# Altium schematic sheet Microcontroller.SchDoc
size A4; SheetNumber: 6; SheetTotal: 9
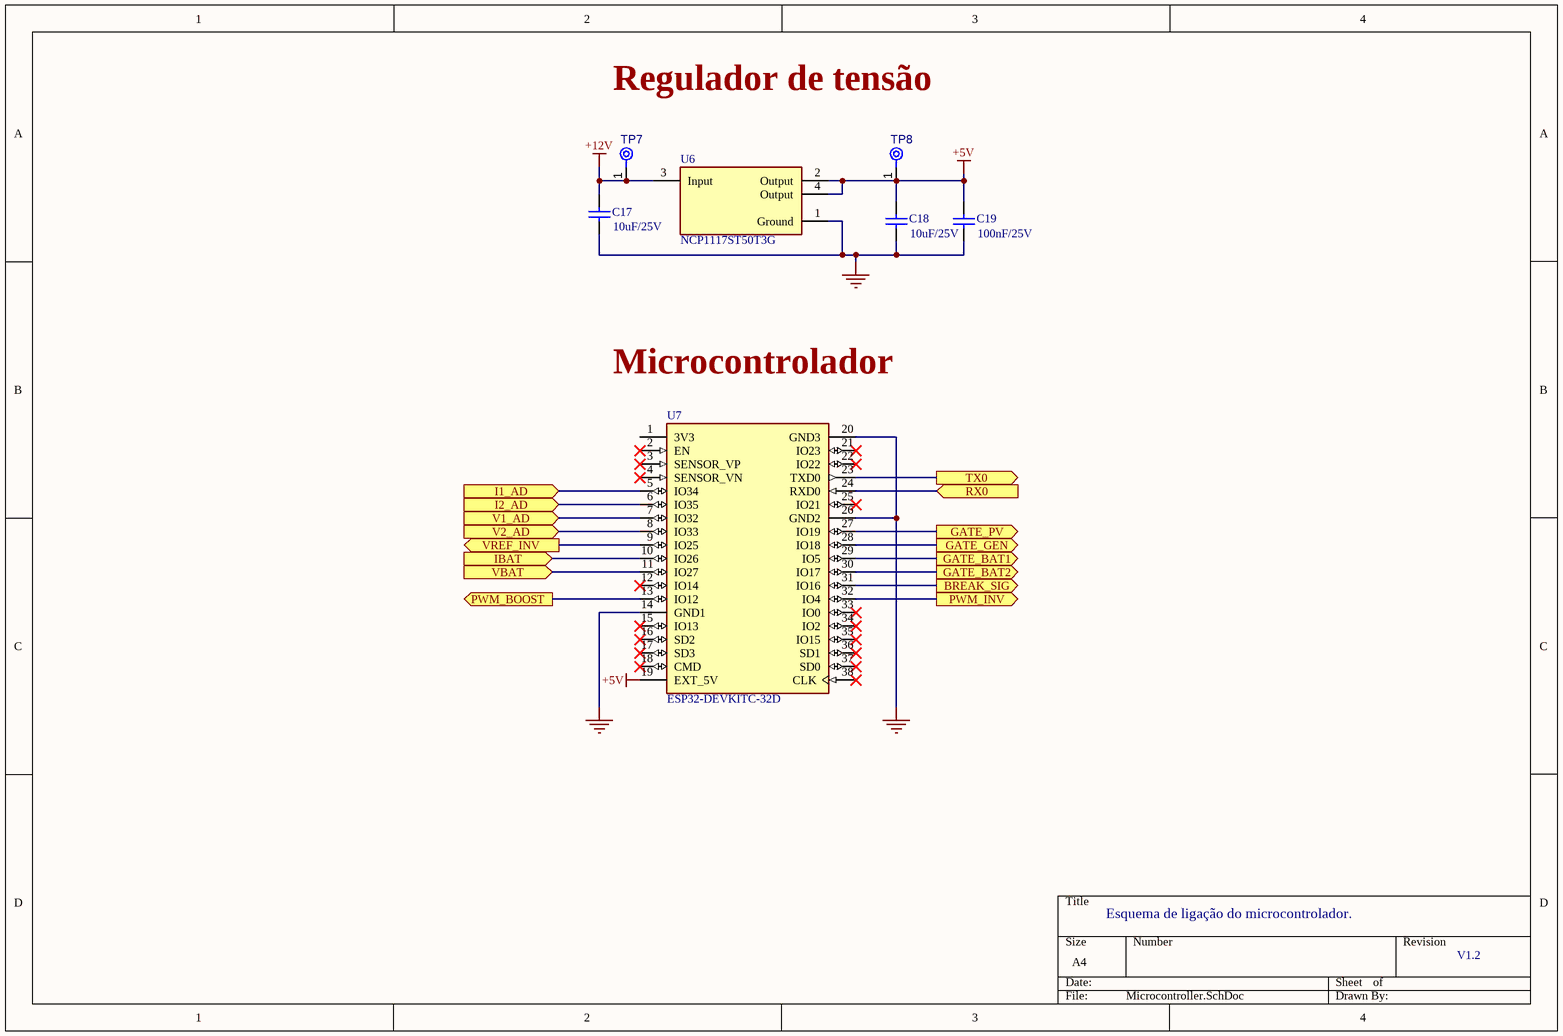
[diagram p0: Microcontroller.SchDoc]

## Parts
C17  value 10uF/25V  [C1206]  (hidden comment: Cap Semi)
C18  value 10uF/25V  [C1206]  (hidden comment: Cap Semi)
C19  value 100nF/25V  [C1206]  (hidden comment: Cap Semi)
TP7  TPAD6R  [TP06R]  (value not drawn)  (no BOM)
TP8  TPAD6R  [TP06R]  (value not drawn)  (no BOM)
U6  NCP1117ST50T3G  [FP-318H-MFG]
U7  ESP32-DEVKITC-32D  [MODULE_ESP32-DEVKITC-32D]

## Ports
BREAK_SIG (out), GATE_BAT1 (out), GATE_BAT2 (out), GATE_GEN (out), GATE_PV (out), I1_AD (in), I2_AD (in), IBAT (in), PWM_BOOST (out), PWM_INV (out), RX0 (in), TX0 (out), V1_AD (in), V2_AD (in), VBAT (in), VREF_INV (out)

## Nets
+5V: C18.2 C19.2 TP8.1(TP) U6.2(Output) U6.4(Output) U7.19(EXT_5V)
+12V: C17.2 TP7.1(TP) U6.3(Input)
GND: C17.1 C18.1 C19.1 U6.1(Ground) U7.14(GND1) U7.20(GND3) U7.26(GND2)
BREAK_SIG: U7.31(IO16) ; port BREAK_SIG
GATE_BAT1: U7.29(IO5) ; port GATE_BAT1
GATE_BAT2: U7.30(IO17) ; port GATE_BAT2
GATE_GEN: U7.28(IO18) ; port GATE_GEN
GATE_PV: U7.27(IO19) ; port GATE_PV
I1_AD: U7.5(IO34) ; port I1_AD
I2_AD: U7.6(IO35) ; port I2_AD
IBAT: U7.10(IO26) ; port IBAT
PWM_BOOST: U7.13(IO12) ; port PWM_BOOST
PWM_INV: U7.32(IO4) ; port PWM_INV
RX0: U7.24(RXD0) ; port RX0
TX0: U7.23(TXD0) ; port TX0
V1_AD: U7.7(IO32) ; port V1_AD
V2_AD: U7.8(IO33) ; port V2_AD
VBAT: U7.11(IO27) ; port VBAT
VREF_INV: U7.9(IO25) ; port VREF_INV

Not connected (* = marked no-connect by the designer): U7 1(3V3) 2(EN)* 3(SENSOR_VP)* 4(SENSOR_VN)* 12(IO14)* 15(IO13)* 16(SD2)* 17(SD3)* 18(CMD)* 21(IO23)* 22(IO22)* 25(IO21)* 33(IO0)* 34(IO2)* 35(IO15)* 36(SD1)* 37(SD0)* 38(CLK)*

## Notes on the sheet
- Regulador de tensão
- Microcontrolador
- Esquema de ligação do microcontrolador.
- V1.2

## Library data of the parts
C17 C18 = Cap Semi: Cap Ceramic 10uF 25V X7R 20% Pad SMD 1206 125C Automotive T/R; Manufacturer: KEMET; Manufacturer Part Number: C1206C106M3RACAUTO; Core Material: Air; Inductance: 1.8nH; Current Rating: 1A; Shielding: Unshielded; DC Resistance (DCR): 40mR; Self Resonant Frequency: 9GHz; Test Frequency: 100MHz; Published: 8-Jun-2000; LatestRevisionDate: 29-May-2009; LatestRevisionNote: IPC-7351 Footprint Added.; PackageReference: C1206; Publisher: Altium Limited; PackageDescription: Chip Capacitor; Supplier 1: Mouser; Supplier Part Number 1: 80-C1206C106M3RAUTO; RoHS: Yes; Category: Ceramic Capacitors; Stock 1: 16243; Pricing 1: 1=0.78000, 10=0.42000, 50=0.42000, 100=0.36600, 1000=0.23000, 10000=0.23000 (USD); Mount: Surface Mount; Case/Package: 1206; Case Code (Imperial): 0402; Case Code (Metric): 1005; Min Operating Temperature: -55°C; Max Operating Temperature: 125°C; Packaging: Cut Tape; Capacitance: 10uF; Tolerance: 20%; Voltage Rating: 25V; Ratings: AEC-Q200; RoHS Compliant: Yes; ComponentLink1URL: http://www.farnell.com/datasheets/2741398.pdf?src-supplier=Farnell; ComponentLink1Description: http://www.farnell.com/datasheets/2741398.pdf?src-supplier=Farnell; ComponentLink2URL: https://api.kemet.com/component-edge/download/datasheet/C1206C106M3RACAUTO.pdf?src-supplier=Digi-Key; ComponentLink2Description: https://api.kemet.com/component-edge/download/datasheet/C1206C106M3RACAUTO.pdf?src-supplier=Digi-Key; ComponentLink3URL: http://www.farnell.com/datasheets/2741398.pdf?src-supplier=Newark; ComponentLink3Description: http://www.farnell.com/datasheets/2741398.pdf?src-supplier=Newark
C19 = Cap Semi: CAP CER 1206 0.1UF 25V C0G 5%; Manufacturer: KEMET; Manufacturer Part Number: C1206C104J3GEC7210; Capacitance: 100nF; Published: 8-Jun-2000; LatestRevisionDate: 29-May-2009; LatestRevisionNote: IPC-7351 Footprint Added.; PackageReference: C1206; Publisher: Altium Limited; PackageDescription: Chip Capacitor; Supplier 1: Mouser; Supplier Part Number 1: 80-C1206C104J3GECLR; RoHS: Yes; Stock 1: 29008; Pricing 1: 1=0.98000, 10=0.65400, 50=0.65400, 100=0.40700, 1000=0.30800, 10000=0.25300 (USD); Mount: Surface Mount; Case/Package: 1206; Min Operating Temperature: -55°C; Max Operating Temperature: 125°C; Packaging: Tape and Reel; Tolerance: 5%; Voltage Rating: 25V; RoHS Compliant: Yes; ComponentLink1URL: https://api.kemet.com/component-edge/download/datasheet/C1206C104J3GEC7210.pdf?src-supplier=Digi-Key; ComponentLink1Description: https://api.kemet.com/component-edge/download/datasheet/C1206C104J3GEC7210.pdf?src-supplier=Digi-Key
TP7 TP8 = CMP-00028-00002-2: 0.6mm round; Pins: 1
U6 = CMP-0592-00001-4: IC REG LINEAR 5V 1A SOT223; Manufacturer: ON Semiconductor; Output Voltage Accuracy: 1%; Number of Outputs: 1; Dropout Voltage: 1.2V; Polarity: Positive; Power Rating: 781mW; Input Bias Current: 6mA; Quiescent Current: 10mA; Output Type: Fixed; Max Input Voltage: 20V; Min Input Voltage: 3.5V; Max Operating Temperature: 125°C; Number of Pins: 4; Case/Package: SOT-223; Min Operating Temperature: 0°C; Accuracy: 1%; Contact Plating: Tin; Min Current Limit: 1A; Output Current: 1A; Max Output Current: 1A; Length: 6.7mm; Packaging: Tape and Reel; Package Quantity: 1; Height: 1.69mm; REACH SVHC: No SVHC; Width: 3.7mm; Halogen Free: Halogen Free; RoHS Compliant: Yes; Nominal Output Voltage: 5V; Lead Free: Lead Free; Radiation Hardening: No; Tolerance: 1%; Number of Regulators: 1; Output Voltage: 5V; Supplier 1: Mouser; Supplier Part Number 1: 863-NCP1117ST50T3G; Manufacturer Part Number: NCP1117ST50T3G; RoHS: Yes; Category: Voltage Regulators - Linear; Stock 1: 312; Pricing 1: 1=0.56000, 10=0.47900, 50=0.47900, 100=0.33200, 1000=0.21700, 10000=0.17400 (USD); ComponentLink1URL: https://datasheet.ciiva.com/28483/1748260-28483320.pdf?src-supplier=Element14; ComponentLink1Description: https://datasheet.ciiva.com/28483/1748260-28483320.pdf?src-supplier=Element14; ComponentLink2URL: https://datasheet.ciiva.com/2042/ncp1117-d-2042018.pdf?src-supplier=Digi-Key; ComponentLink2Description: https://datasheet.ciiva.com/2042/ncp1117-d-2042018.pdf?src-supplier=Digi-Key; ComponentLink3URL: https://datasheet.ciiva.com/2042/ncp1117-d-2042019.pdf?src-supplier=Digi-Key; ComponentLink3Description: https://datasheet.ciiva.com/2042/ncp1117-d-2042019.pdf?src-supplier=Digi-Key; ComponentLink4URL: https://datasheet.ciiva.com/2042/ncp1117-d-2042020.pdf?src-supplier=Digi-Key; ComponentLink4Description: https://datasheet.ciiva.com/2042/ncp1117-d-2042020.pdf?src-supplier=Digi-Key; ComponentLink5URL: https://datasheet.ciiva.com/8231/ncp1117-d-8231068.pdf?src-supplier=Avnet; ComponentLink5Description: https://datasheet.ciiva.com/8231/ncp1117-d-8231068.pdf?src-supplier=Avnet; ComponentLink6URL: https://datasheet.ciiva.com/8233/ncp1117-d-8233593.pdf?src-supplier=Avnet; ComponentLink6Description: https://datasheet.ciiva.com/8233/ncp1117-d-8233593.pdf?src-supplier=Avnet; ComponentLink7URL: https://datasheet.ciiva.com/16491/ncp1117-d-16491895.pdf?src-supplier=Avnet+Asia; ComponentLink7Description: https://datasheet.ciiva.com/16491/ncp1117-d-16491895.pdf?src-supplier=Avnet+Asia; ComponentLink8URL: https://datasheet.ciiva.com/16209/ncp1117-d-16209561.pdf?src-supplier=Future+Electronics; ComponentLink8Description: https://datasheet.ciiva.com/16209/ncp1117-d-16209561.pdf?src-supplier=Future+Electronics; ComponentLink9URL: https://datasheet.ciiva.com/8073/ncp1117-d-8073736.pdf?src-supplier=Element14; ComponentLink9Description: https://datasheet.ciiva.com/8073/ncp1117-d-8073736.pdf?src-supplier=Element14; ComponentLink10URL: https://datasheet.ciiva.com/8073/ncp1117-d-8073902.pdf?src-supplier=Element14; ComponentLink10Description: https://datasheet.ciiva.com/8073/ncp1117-d-8073902.pdf?src-supplier=Element14; ComponentLink11URL: https://datasheet.ciiva.com/25978/ncp1117-d-25978293.pdf?src-supplier=Avnet+Europe; ComponentLink11Description: https://datasheet.ciiva.com/25978/ncp1117-d-25978293.pdf?src-supplier=Avnet+Europe
U7 = ESP32-DEVKITC-32D: Espressif Systems ESP32-DevKitC Microcontroller; Frequency: 2.5GHz; Interface: USB; Operating Supply Voltage: 5V; Value: *; MP: ESP32-DEVKITC-32D; Price: None; Check_prices: https://www.snapeda.com/parts/ESP32-DEVKITC-32D/Espressif%20Systems/view-part/2777395/?ref=eda; MF: Espressif Systems; SnapEDA_Link: https://www.snapeda.com/parts/ESP32-DEVKITC-32D/Espressif%20Systems/view-part/2777395/?ref=snap; Availability: Warning; Purchase-URL: https://pricing.snapeda.com/search/part/ESP32-DEVKITC-32D/?ref=eda; Package: None; Supplier 1: Mouser; Supplier Part Number 1: 356-ESP32-DEVKITC32D; Manufacturer: Espressif Systems; Manufacturer Part Number: ESP32-DEVKITC-32D; RoHS: No; Stock 1: 1492; Pricing 1: 1=10.00000, 10=10.00000, 50=10.00000, 100=10.00000, 1000=10.00000, 10000=10.00000 (USD); Package Quantity: 1; ComponentLink1URL: https://datasheet.ciiva.com/70828/esp32-devkit-70828764.pdf?src-supplier=TME; ComponentLink1Description: https://datasheet.ciiva.com/70828/esp32-devkit-70828764.pdf?src-supplier=TME